# EAGLE schematic main (EAGLE 7.5.0)
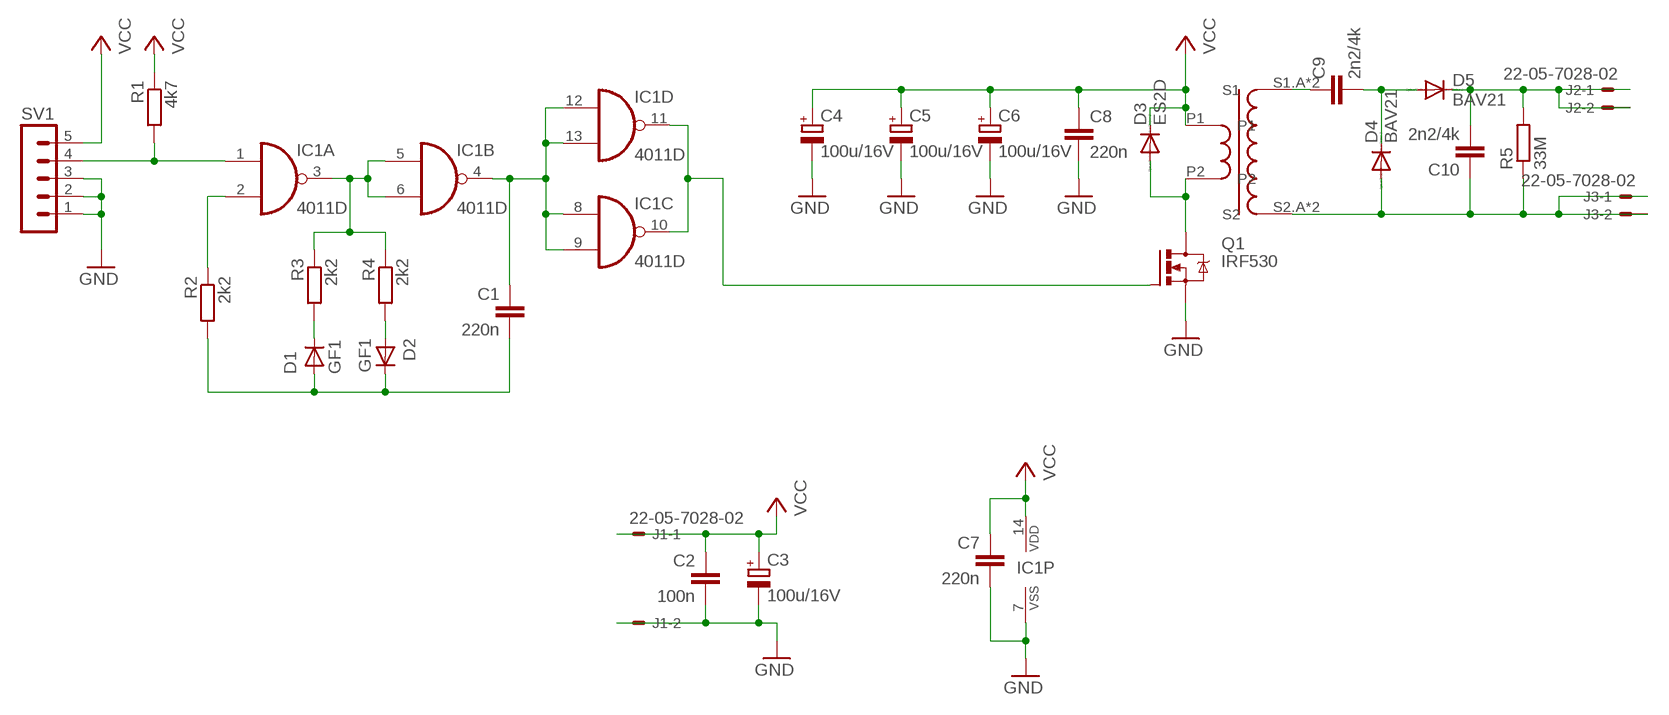
[diagram p0: schematic, sheet 1]

## Parts
11  CCFL_INVERTER_COIL  [CCFL_INVERTER_COIL]
C1  220n  C-EU025-025X050  [C025-025X050]
C2  100n  C-EUC0805  [C0805]
C3  100u/16V  CPOL-EU153CLV-0505  [153CLV-0505]
C4  100u/16V  CPOL-EU153CLV-0505  [153CLV-0505]
C5  100u/16V  CPOL-EU153CLV-0505  [153CLV-0505]
C6  100u/16V  CPOL-EU153CLV-0505  [153CLV-0505]
C7  220n  C-EUC0805  [C0805]
C8  220n  C-EUC0805  [C0805]
C9  2n2/4k  C-EU075-042X103  [C075-042X103]
C10  2n2/4k  C-EU075-042X103  [C075-042X103]
D1  GF1  [SMA-DO214AC]
D2  GF1  [SMA-DO214AC]
D3  ES2D  [SMB]
D4  BAV21  [DO35-10]
D5  BAV21  [DO35-10]
IC1  4011D  [SO14]
J1  22-05-7028-02  [7395-02]
J2  22-05-7028-02  [7395-02]
J3  22-05-7028-02  [7395-02]
Q1  IRF530  [TO220BV]
R1  4k7  R-EU_M0805  [M0805]
R2  2k2  R-EU_M0805  [M0805]
R3  2k2  R-EU_M0805  [M0805]
R4  2k2  R-EU_M0805  [M0805]
R5  33M  R-EU_0207/10  [0207/10]
SV1  MA05-1  [MA05-1]

## Nets
GND: C2.2 C3.- C4.- C5.- C6.- C7.2 C8.2 IC1.7(P:VSS) J1.2 Q1.S SV1.1 SV1.2 SV1.3
N$1: IC1.2(A:I1) R2.1
N$2: IC1.1(A:I0) R1.2 SV1.4
N$3: 11.P2 D3.A Q1.D
N$4: IC1.10(C:O) IC1.11(D:O) Q1.G
N$5: C1.1 IC1.4(B:O) IC1.8(C:I0) IC1.9(C:I1) IC1.12(D:I0) IC1.13(D:I1)
N$6 [high_voltage]: 11.S1.A(S1) 11.S1.B(S1) C9.1
N$7 [high_voltage]: C9.2 D4.C D5.A
N$10 [high_voltage]: C10.2 D5.C J2.1 J2.2 R5.2
N$11 [high_voltage]: 11.S2.A(S2) 11.S2.B(S2) C10.1 D4.A J3.1 J3.2 R5.1
N$22: IC1.3(A:O) IC1.5(B:I0) IC1.6(B:I1) R3.1 R4.1
N$23: C1.2 D1.A D2.K(C) R2.2
N$24: D1.K(C) R3.2
N$25: D2.A R4.2
VCC: 11.P1 C2.1 C3.+ C4.+ C5.+ C6.+ C7.1 C8.1 D3.C IC1.14(P:VDD) J1.1 R1.1 SV1.5

## Library data of the parts
11 = ccfl_inverter_coil:CCFL_INVERTER_COIL: CCFL inverter coil.
C1 C2 C7 C8 C10 = resistor:C-EU: CAPACITOR, European symbol
C3 C4 C6 = rcl:CPOL-EU: POLARIZED CAPACITOR, European symbol
C5 = resistor:CPOL-EU: POLARIZED CAPACITOR, European symbol
C9 = rcl:C-EU: CAPACITOR, European symbol
D1 D2 = diode:GF1: DIODE
D3 = diode:ES2D: DIODE super fast rectifier, 2 A
D4 D5 = diode:BAV21: DIODE high-voltage general purpose diode
IC1 = 40xx:4011: Quad 2-input NAND
J1-J3 = con-molex:22-?-02: CONNECTOR wire to board 2.54 mm (.1 inch) pitch header; OC_FARNELL: 9731601; OC_NEWARK: unknown
Q1 = transistor-power:IRF530: HEXFET Power MOSFET
R1-R5 = resistor:R-EU_: RESISTOR, European symbol
SV1 = con-lstb:MA05-1: PIN HEADER; OC_FARNELL: unknown; OC_NEWARK: unknown

## Net classes
0 signal: width 0.559 mm, drill 0.254 mm, clearance 0.254 mm
1 high_voltage: width 8.915 mm, clearance 0.889 mm
2 power_supply: width 0.559 mm